# Altium project Adapter.PrjPcb
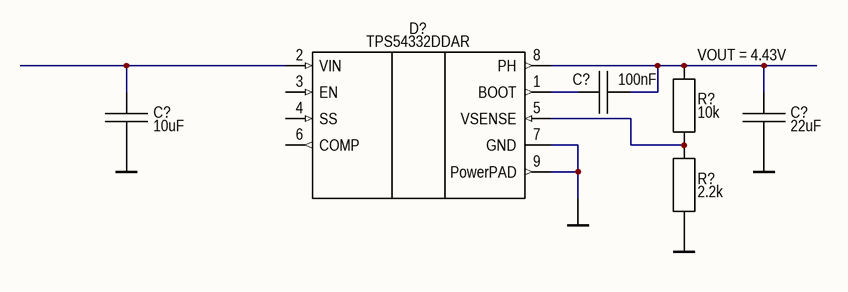
[diagram p0: Adapter.SchDoc]
1 sheet, 6 parts. Net scope: global (net labels, ports and power ports of the same name join across sheets).

## Sheet Adapter.SchDoc
size 420 x 297 mm; Scale: 1:1; DocumentType: Схема электрическая принципиальная; FirstReferrence: АБВГ.123456.001; PageSetup: Record=PageOptions|CenterHorizontal=True|CenterVertical=True|PrintScale=1.00|XCorrection=1.00|YCorrection=1.00|PrintKind=1|BorderSize=5000000|LeftOffset=0|BottomOffset=0|Orientation=2|PaperLength=1000|PaperWidth=1000|Scale=100|PaperSource=15|PrintQuality=1200|MediaType=1|DitherType=10|PaperKind=A3|PrintScaleMode=1; Weight: -; ScaleFactor: -

### Parts
(Parts that share a designator on the sheet are numbered #1, #2 ... from top to bottom, then left to right.)
C?#1  value 10uF  [CAP: 1206]  (hidden comment: C1206)
C?#2  value 100nF  [CAP: 0603]  (hidden comment: C0603)
C?#3  value 22uF  [CAP: 1210]  (hidden comment: C1210)
D?  ManufacturerPartNumber: TPS54332DDAR  [SOIC-8 POWERPAD]  (hidden comment: TPS54332)
R?#1  value 10k  [RES: 0603]  (hidden comment: R0603)
R?#2  value 2.2k  [RES: 0603]  (hidden comment: R0603)

### Nets
GND: C?#1.2 C?#3.2 D?.7(GND) D?.9(PowerPAD) R?#2.2
NetC?#1_1: C?#1.1 D?.2(VIN)
NetC?#2_1: C?#2.1 D?.1(BOOT)
NetC?#2_2: C?#2.2 C?#3.1 D?.8(PH) R?#1.1
NetD?_5: D?.5(VSENSE) R?#1.2 R?#2.1

Not connected (* = marked no-connect by the designer): D? 3(EN) 4(SS) 6(COMP)

### Notes on the sheet
- (near R?#1) VOUT = 4.43V
- Перв. примен.
- Справ. №
- Подп. и дата
- Инв. № дубл.
- Взам. инв. №
- Разраб.
- Изм.
- Лист
- № докум.
- Подп.
- Дата
- Лит.
- Масса
- Масштаб
- Пров.
- Т.контр.
- Листов
- Инв. № подл.
- Утв.
- Н.контр.
- 2.106-A3
- Копировал
- Формат А3

### Library data of the parts
C?#1 = C1206: SMD Capacitor; Tolerance: ±10%; TKE: X5R; Voltage: 16V; Case: 1206; Height: *
C?#2 = C0603: SMD Capacitor; Tolerance: ±10%; TKE: X7R; Voltage: 16V; Case: 0603; Height: *
C?#3 = C1210: SMD Capacitor; Tolerance: ±10%; TKE: X5R; Voltage: 25V; Case: 1210; Height: *
D? = TPS54332: Buck Converter; Manufacturer: Texas Instruments; ComponentLink1Description: Datasheet; ComponentLink1URL: https://www.ti.com/lit/ds/symlink/tps54332.pdf; ComponentLink2Description: Supplier; ComponentLink2URL: https://www.chipdip.ru/product/tps54332dda; Case: SOIC-8 PowerPAD
R?#1 R?#2 = R0603: Resistor SMD; Power: 0.1W; Tolerance: ±5%; Case: 0603